# EAGLE design sch1 (EAGLE 9.6.2)
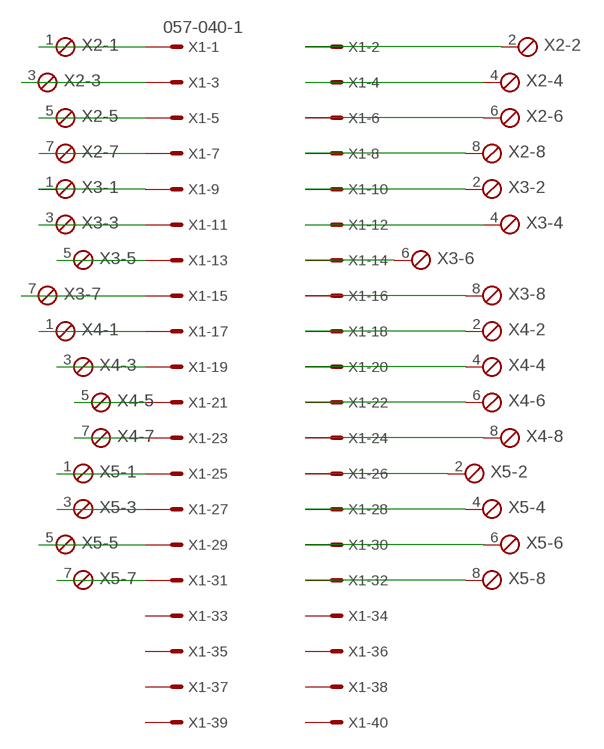
[diagram p0: schematic, sheet 1]

## Parts
X1  057-040-1  [057-040-1]
X2  MPT8  [8POL254]
X3  MPT8  [8POL254]
X4  MPT8  [8POL254]
X5  MPT8  [8POL254]

## Nets
N$1: X1.1 X2.1
N$2: X1.2 X2.2
N$3: X1.3 X2.3
N$4: X1.4 X2.4
N$5: X1.5 X2.5
N$6: X1.6 X2.6
N$7: X1.7 X2.7
N$8: X1.8 X2.8
N$9: X1.9 X3.1
N$10: X1.10 X3.2
N$11: X1.11 X3.3
N$12: X1.12 X3.4
N$13: X1.13 X3.5
N$14: X1.14 X3.6
N$15: X1.15 X3.7
N$16: X1.16 X3.8
N$17: X1.17 X4.1
N$18: X1.18 X4.2
N$19: X1.19 X4.3
N$20: X1.20 X4.4
N$21: X1.21 X4.5
N$22: X1.22 X4.6
N$23: X1.23 X4.7
N$24: X1.24 X4.8
N$25: X1.25 X5.1
N$26: X1.26 X5.2
N$27: X1.27 X5.3
N$28: X1.28 X5.4
N$29: X1.29 X5.5
N$30: X1.30 X5.6
N$31: X1.31 X5.7
N$32: X1.32 X5.8
Unconnected: X1.33 X1.34 X1.35 X1.36 X1.37 X1.38 X1.39 X1.40

## Library data of the parts
X1 = con-panduit:057-040-: CONNECTOR 40-pin series 057 contact pc board low profile headers; OC_FARNELL: unknown; OC_NEWARK: unknown
X2-X5 = con-phoenix-254:MPT8: PHOENIX CONNECTOR; OC_FARNELL: unknown; OC_NEWARK: unknown

## Board
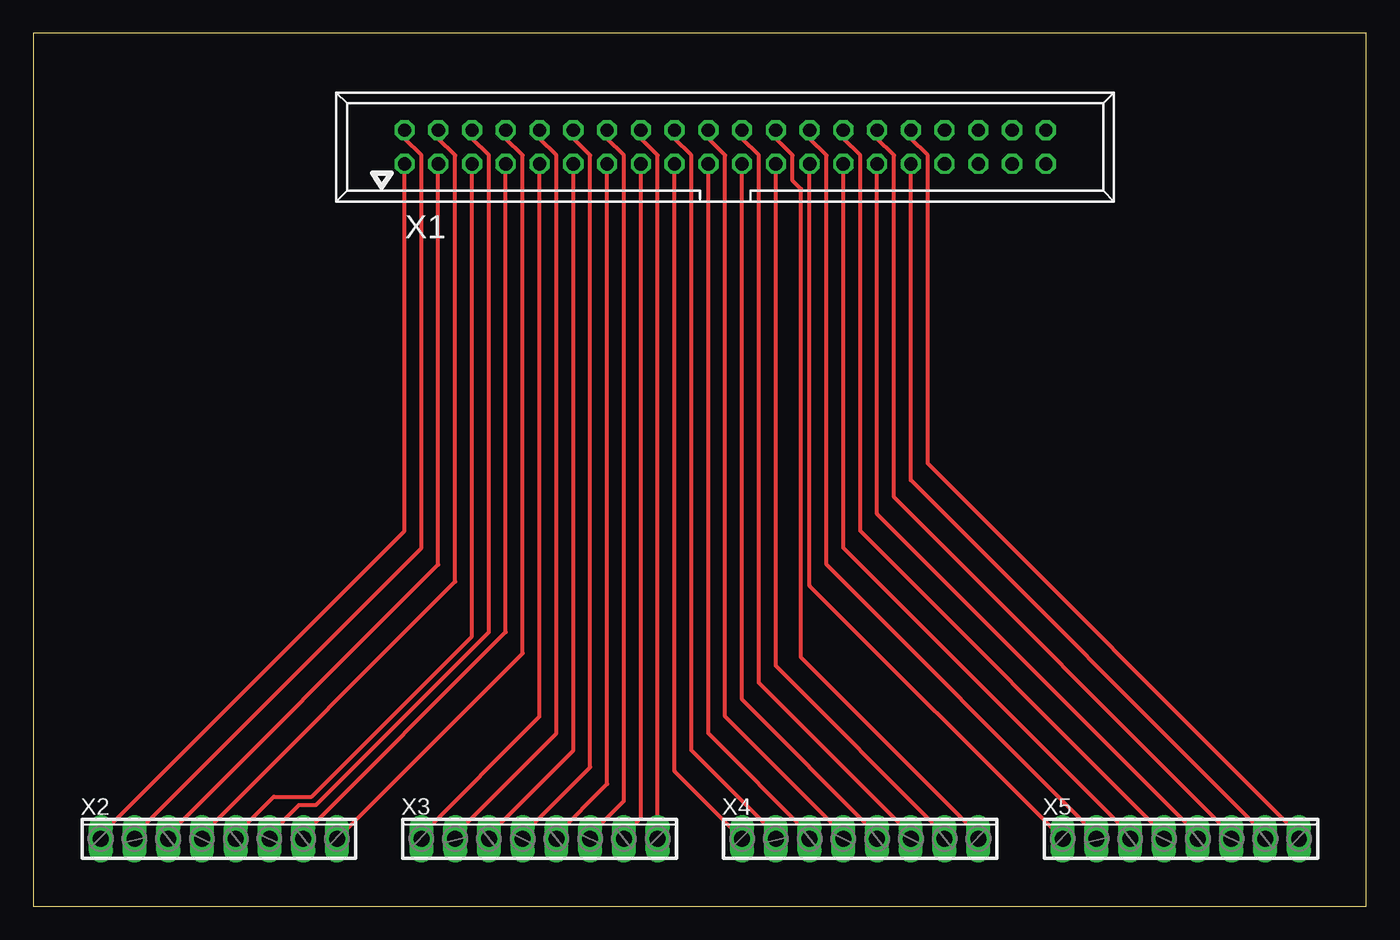
[diagram p1: board, top side]

Size 100.31 x 65.71 mm. Coordinates in mm from the lower left corner, seen from the top.
Outline: 0,0 100.31,0 100.31,65.71 0,65.71 0,0
Copper layers (1*16): Top 0.035mm / dielectric 1.5mm / Bottom 0.035mm
Design rules "default *": minimum track width 12mil, minimum drill 0.35mm, track to track 12mil, track to pad 12mil, pad to pad 12mil, via to via 12mil, smd to smd 12mil, copper to edge 40mil, drill to drill 12mil, minimum pad ring 10mil, minimum via ring 8mil, stop-mask expansion 4mil, vias tented up to drill 0mil, thermal gap 10mil

### Footprints (pad centres in the part's own frame; a part is rotated, then mirrored left to right if it is on the bottom)
057-040-1 = drill 1 octagon: 1 -24.13,-1.27; 2 -24.13,1.27; 3 -21.59,-1.27; 4 -21.59,1.27; 5 -19.05,-1.27; 6 -19.05,1.27; 7 -16.51,-1.27; 8 -16.51,1.27; 9 -13.97,-1.27; 10 -13.97,1.27; 11 -11.43,-1.27; 12 -11.43,1.27; 13 -8.89,-1.27; 14 -8.89,1.27; 15 -6.35,-1.27; 16 -6.35,1.27; 17 -3.81,-1.27; 18 -3.81,1.27; 19 -1.27,-1.27; 20 -1.27,1.27; 21 1.27,-1.27; 22 1.27,1.27; 23 3.81,-1.27; 24 3.81,1.27; 25 6.35,-1.27; 26 6.35,1.27; 27 8.89,-1.27; 28 8.89,1.27; 29 11.43,-1.27; 30 11.43,1.27; 31 13.97,-1.27; 32 13.97,1.27; 33 16.51,-1.27; 34 16.51,1.27; 35 19.05,-1.27; 36 19.05,1.27; 37 21.59,-1.27; 38 21.59,1.27; 39 24.13,-1.27; 40 24.13,1.27
8POL254 = drill 1.2 long: 1 -8.89,0; 2 -6.35,0; 3 -3.81,0; 4 -1.27,0; 5 1.27,0; 6 3.81,0; 7 6.35,0; 8 8.89,0

### Placement (x,y rotation side)
X1  52.07,57.15 0 top
X2  13.97,5.08 0 top
X3  38.1,5.08 0 top
X4  62.23,5.08 0 top
X5  86.36,5.08 0 top

### Tracks (layer width: path | path; a pad name or v marks a point on that pad's centre or on a via)
N$1
  Top 0.305: X1.1 27.94,28.26 5.08,5.4 X2.1
N$2
  Top 0.305: X1.2 27.94,57.78 29.21,56.52 29.21,26.99 7.62,5.4 X2.2
N$3
  Top 0.305: X1.3 30.48,25.72 10.16,5.4 X2.3
N$4
  Top 0.305: X1.4 30.48,57.78 31.75,56.52 31.75,24.45 12.7,5.4 X2.4
N$5
  Top 0.305: X1.5 33.02,20.32 20.95,8.26 18.1,8.26 15.24,5.4 X2.5
N$6
  Top 0.305: X1.6 33.02,57.78 34.29,56.52 34.29,20.64 21.27,7.62 20,7.62 17.78,5.4 X2.6
N$7
  Top 0.305: X1.7 35.56,20.64 20.32,5.4 X2.7
N$8
  Top 0.305: X1.8 35.56,57.78 36.83,56.52 36.83,19.05 X2.8
N$9
  Top 0.305: X1.9 38.1,14.29 29.21,5.4 X3.1
N$10
  Top 0.305: X1.10 38.1,57.78 39.37,56.52 39.37,13.02 31.75,5.4 X3.2
N$11
  Top 0.305: X1.11 40.64,11.75 34.29,5.4 X3.3
N$12
  Top 0.305: X1.12 40.64,57.78 41.91,56.52 41.91,10.48 36.83,5.4 X3.4
N$13
  Top 0.305: X1.13 43.18,9.21 39.37,5.4 X3.5
N$14
  Top 0.305: X1.14 43.18,57.78 44.45,56.52 44.45,7.94 41.91,5.4 X3.6
N$15
  Top 0.305: X1.15 45.72,6.67 44.45,5.4 X3.7
N$16
  Top 0.305: X1.16 45.72,57.78 46.99,56.52 X3.8
N$17
  Top 0.305: X1.17 48.26,10.16 X4.1
N$18
  Top 0.305: X1.18 48.26,57.78 49.53,56.52 49.53,11.75 55.88,5.4 X4.2
N$19
  Top 0.305: X1.19 50.8,13.02 58.42,5.4 X4.3
N$20
  Top 0.305: X1.20 50.8,57.78 52.07,56.52 52.07,14.29 60.96,5.4 X4.4
N$21
  Top 0.305: X1.21 53.34,15.56 63.5,5.4 X4.5
N$22
  Top 0.305: X1.22 53.34,57.78 54.61,56.52 54.61,16.83 66.04,5.4 X4.6
N$23
  Top 0.305: X1.23 55.88,18.1 68.58,5.4 X4.7
N$24
  Top 0.305: X1.24 55.88,57.78 57.15,56.52 57.15,54.61 57.78,53.98 57.78,18.73 71.12,5.4 X4.8
N$25
  Top 0.305: X1.25 58.42,24.13 X5.1
N$26
  Top 0.305: X1.26 58.42,57.78 59.69,56.52 59.69,25.72 80.01,5.4 X5.2
N$27
  Top 0.305: X1.27 60.96,26.99 82.55,5.4 X5.3
N$28
  Top 0.305: X1.28 60.96,57.78 62.23,56.52 62.23,28.26 85.09,5.4 X5.4
N$29
  Top 0.305: X1.29 63.5,29.53 87.63,5.4 X5.5
N$30
  Top 0.305: X1.30 63.5,57.78 64.77,56.52 64.77,30.8 90.17,5.4 X5.6
N$31
  Top 0.305: X1.31 66.04,32.07 92.71,5.4 X5.7
N$32
  Top 0.305: X1.32 66.04,57.78 67.31,56.52 67.31,33.34 95.25,5.4 X5.8